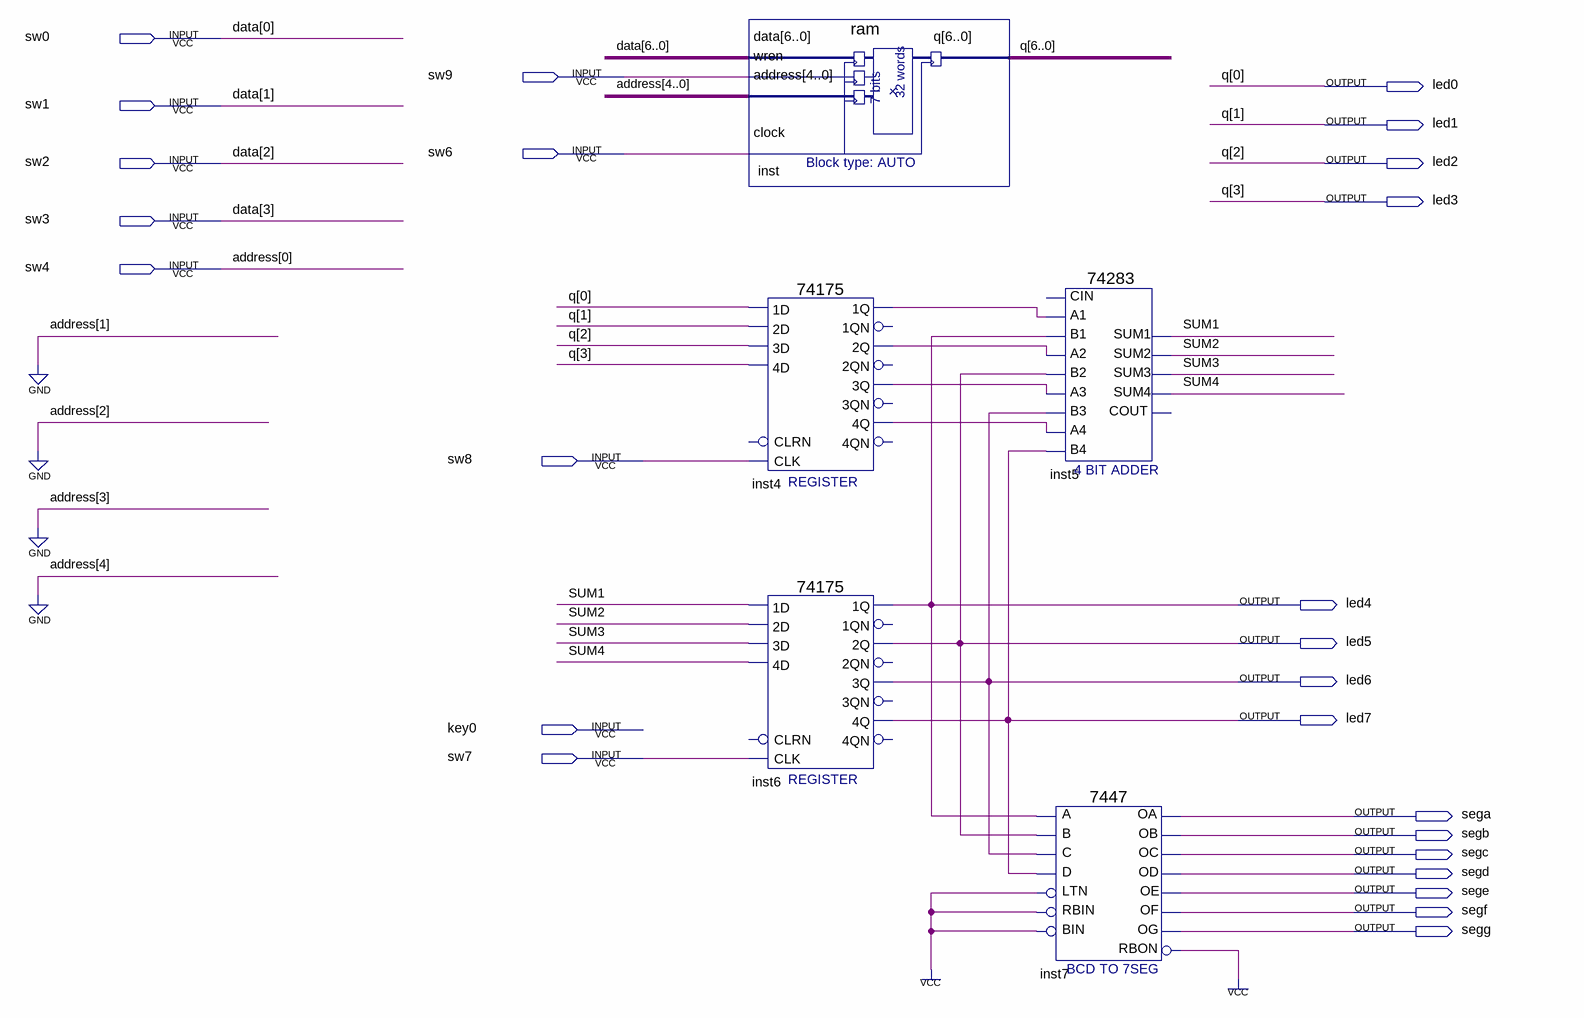
[diagram p0: schematic sheet]
// Quartus schematic SimpleArithmetic.bdf as structural Verilog: 5 symbols, 25 pins
module SimpleArithmetic (
  input  sw0,
  input  sw9,
  input  sw1,
  input  sw6,
  input  sw2,
  input  sw3,
  input  sw4,
  input  sw8,
  input  key0,
  input  sw7,
  output led0,
  output led1,
  output led2,
  output led3,
  output led4,
  output led5,
  output led6,
  output led7,
  output sega,
  output segb,
  output segc,
  output segd,
  output sege,
  output segf,
  output segg
);

  wire inst4_1q, inst4_2q, inst4_3q, inst4_4q, inst7_rbon, SUM1, SUM2, SUM3, SUM4;
  wire [6:4] data, q;

  ram inst (
    .data({data, sw3, sw2, sw1, sw0}), .wren(sw9), .address({4'b0000, sw4}), .clock(sw6),
    .q({q, led3, led2, led1, led0}));
  \74175  inst4 (
    .CLK(sw8), .\3D (led2), .\2D (led1), .\1D (led0), .\4D (led3), .\1Q (inst4_1q), .\3Q (inst4_3q),
    .\2Q (inst4_2q), .\4Q (inst4_4q));  // open: CLRN, 1QN, 2QN, 4QN, 3QN
  \74175  inst6 (
    .CLK(sw7), .\3D (SUM3), .\2D (SUM2), .\1D (SUM1), .\4D (SUM4), .\1Q (led4), .\3Q (led6), .\2Q (led5),
    .\4Q (led7));  // open: CLRN, 1QN, 2QN, 4QN, 3QN
  \74283  inst5 (
    .A1(inst4_1q), .A2(inst4_2q), .B2(led5), .A3(inst4_3q), .A4(inst4_4q), .B4(led7), .B1(led4), .B3(led6),
    .SUM4(SUM4), .SUM1(SUM1), .SUM2(SUM2), .SUM3(SUM3));  // open: CIN, COUT
  \7447  inst7 (
    .LTN(1'b1), .B(led5), .C(led6), .D(led7), .RBIN(1'b1), .BIN(1'b1), .A(led4), .OB(segb), .OC(segc),
    .OE(sege), .OD(segd), .OF(segf), .OG(segg), .OA(sega), .RBON(inst7_rbon));
  // also tied to VCC on the sheet: inst7_rbon

  // Other names for the same wires on the sheet: address[0] = sw4; data[3:0] = {sw3, sw2, sw1, sw0};
  //   q[3:0] = {led3, led2, led1, led0}
endmodule
